# EAGLE design emonTx4-PiPico (EAGLE 9.6.2)
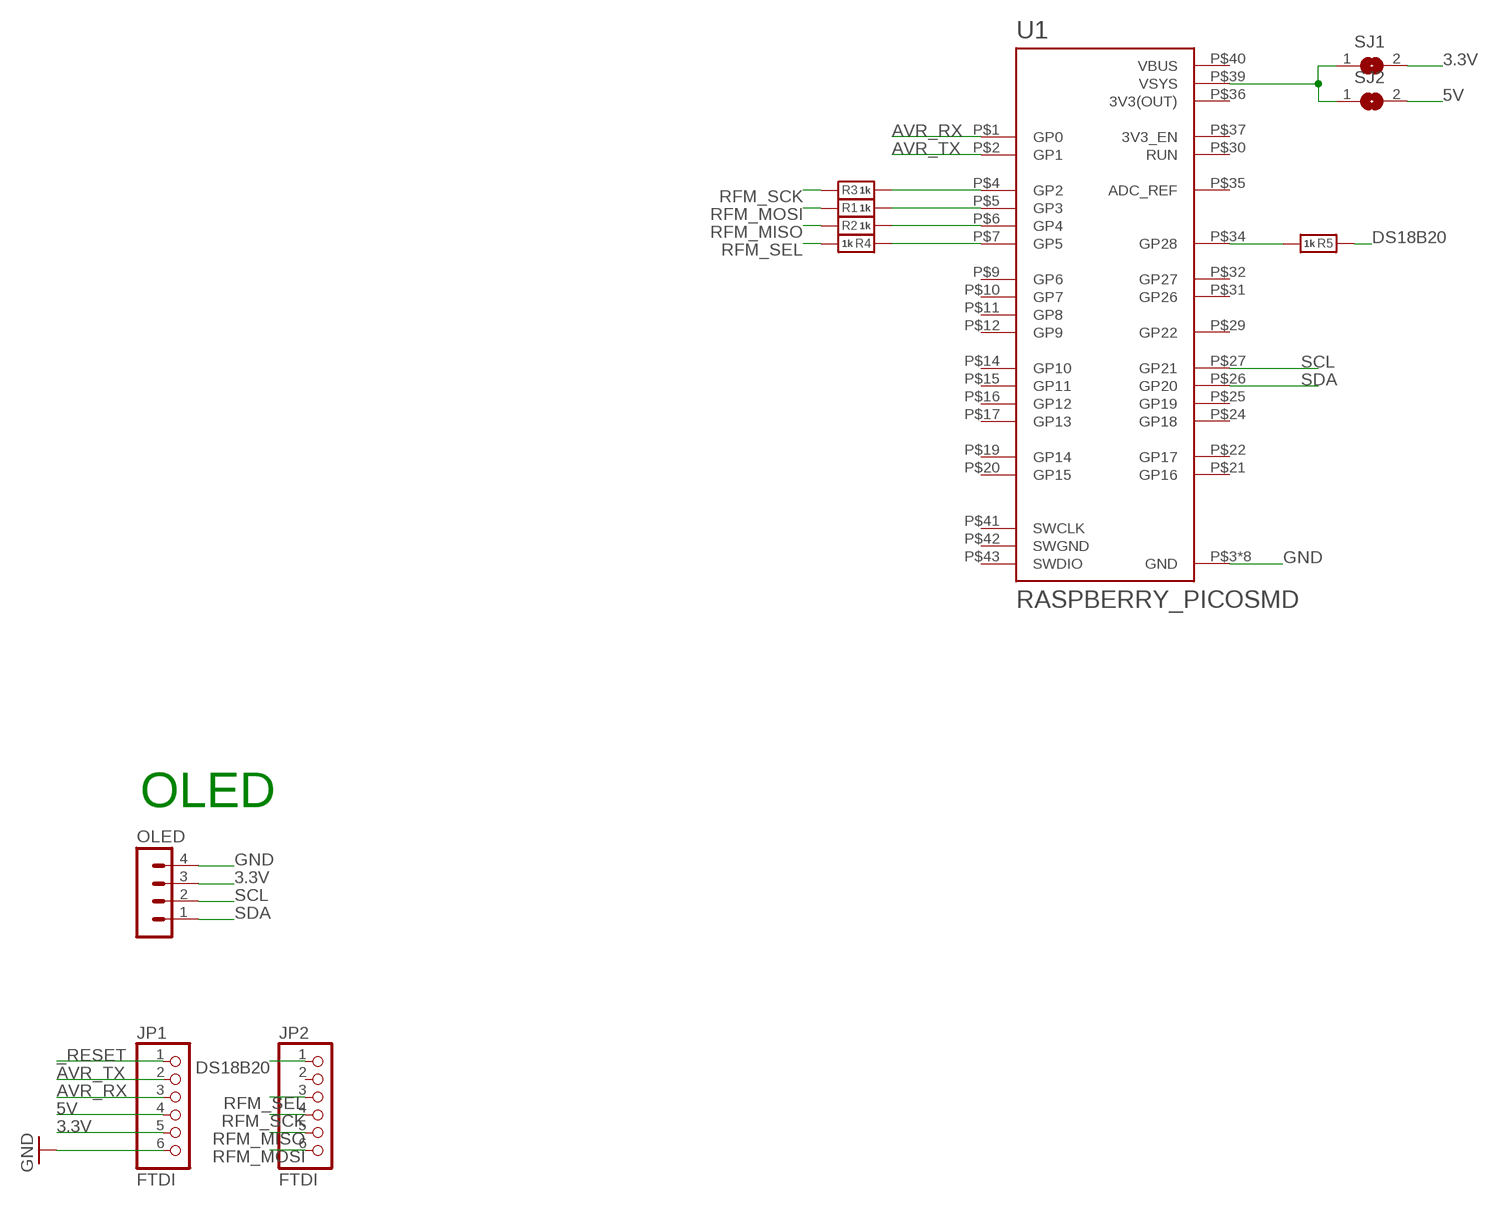
[diagram p0: schematic, sheet 1]

## Parts
JP1  FTDI  HEADER-1X670MIL  [1X06_ROUND_70]
JP2  FTDI  HEADER-1X670MIL  [1X06_ROUND_70]
OLED  MA04-1-OLEDOLED  [MA04-1-OLED]
R1  1k  RESISTOR_0603  [_0603]
R2  1k  RESISTOR_0603  [_0603]
R3  1k  RESISTOR_0603  [_0603]
R4  1k  RESISTOR_0603  [_0603]
R5  1k  RESISTOR_0603  [_0603]
SJ1  SJ  [SJ]
SJ2  SJ  [SJ]
U1  RASPBERRY_PICOSMD  [PICO-PKG-SMD]

## Nets
3.3V: JP1.5 OLED.3 SJ1.2
5V: JP1.4 SJ2.2
_RESET: JP1.1
AVR_RX: JP1.3 U1.P$1(GP0)
AVR_TX: JP1.2 U1.P$2(GP1)
DS18B20: JP2.1 R5.2
GND: JP1.6 OLED.4 U1.P$3(GND) U1.P$8(GND) U1.P$13(GND) U1.P$18(GND) U1.P$23(GND) U1.P$28(GND) U1.P$33(GND) U1.P$38(GND)
N$1: SJ1.1 SJ2.1 U1.P$39(VSYS)
N$4: R3.1 U1.P$4(GP2)
N$5: R1.1 U1.P$5(GP3)
N$6: R2.1 U1.P$6(GP4)
N$7: R4.2 U1.P$7(GP5)
N$8: R5.1 U1.P$34(GP28)
RFM_MISO: JP2.5 R2.2
RFM_MOSI: JP2.6 R1.2
RFM_SCK: JP2.4 R3.2
RFM_SEL: JP2.3 R4.1
SCL: OLED.2 U1.P$27(GP21)
SDA: OLED.1 U1.P$26(GP20)
Unconnected: JP2.2 U1.P$9(GP6) U1.P$10(GP7) U1.P$11(GP8) U1.P$12(GP9) U1.P$14(GP10) U1.P$15(GP11) U1.P$16(GP12) U1.P$17(GP13) U1.P$19(GP14) U1.P$20(GP15) U1.P$21(GP16) U1.P$22(GP17) U1.P$24(GP18) U1.P$25(GP19) U1.P$29(GP22) U1.P$30(RUN) U1.P$31(GP26) U1.P$32(GP27) U1.P$35(ADC_REF) U1.P$37(3V3_EN) U1.P$41(SWCLK) U1.P$43(SWDIO)

## Notes on the sheet
- OLED

## Power pins joined to a net without a drawn wire
3V3(OUT): U1.P$36(3V3(OUT))
SWGND: U1.P$42(SWGND)
VBUS: U1.P$40(VBUS)

## Library data of the parts
JP1 JP2 = microbuilder:HEADER-1X6: PIN HEADER
OLED = con-lstb-db:MA04-1-OLED: PIN HEADER with OLED footprint.
R1-R5 = microbuilder:RESISTOR: Resistors For new designs, use the packages preceded by an '_' character since they are more reliable: The following footprints should be used on most boards: _0402 - Standard footprint for regular board layouts _0603 - Standard footprint for regular board layouts _0805 - Standard footprint for regular board layouts _1206 - Standard footprint for regular board layouts For extremely tight-pitch boards where space is at a premium, the following 'micro-pitch' footprints can be used (smaller pads, no silkscreen outline, etc.): _0402MP - Micro-pitch footprint for very dense/compact boards _0603MP - Micro-pitch footprint for very dense/compact boards _0805MP - Micro-pitch footprint for very dense/compact boards _1206MP - Micro-pitch footprint for very dense/compact boards
SJ1 SJ2 = jumper:SJ: SMD solder JUMPER
U1 = RpiPico:RASPBERRY_PICO: Raspberry Pi Pico

## Net classes
1 power: width 0.254 mm, drill 0.5 mm, clearance 0.152 mm
2 gnd: width 0.254 mm, drill 0.5 mm, clearance 0.152 mm

## Board
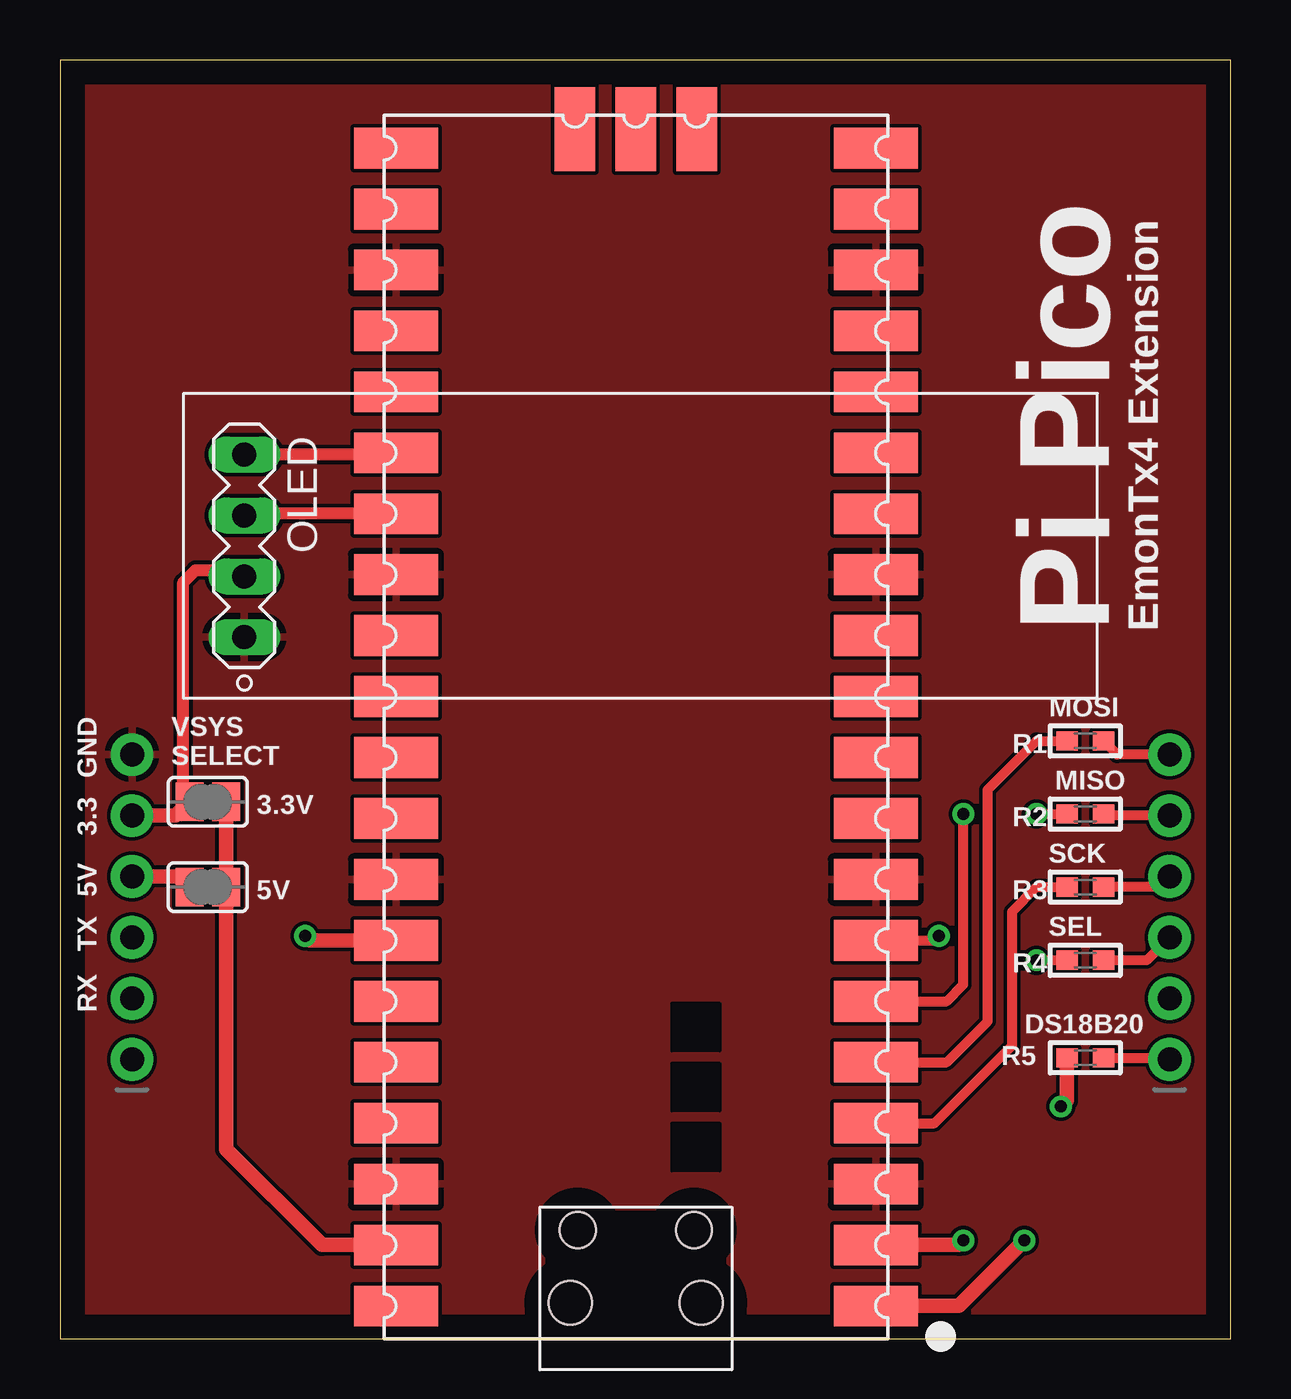
[diagram p1: board, top side]
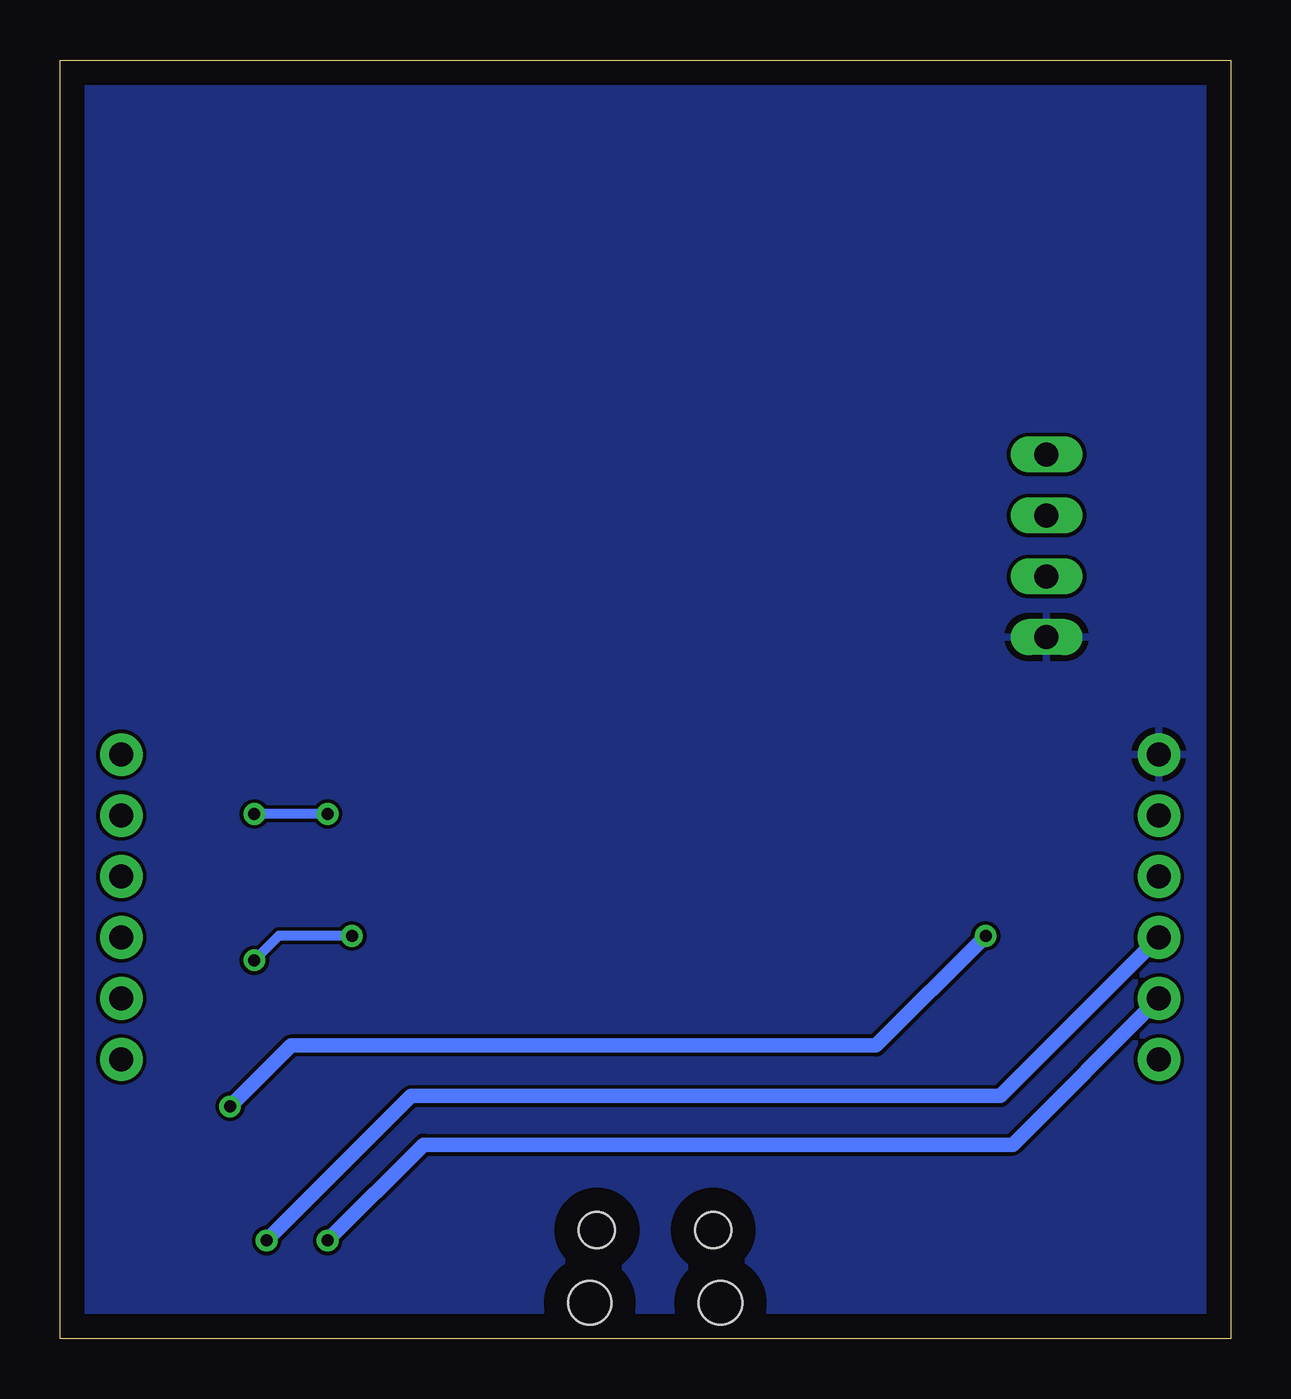
[diagram p2: board, bottom side, seen from below]

Size 48.81 x 53.3 mm. Coordinates in mm from the lower left corner, seen from the top.
Outline: 48.81,0 48.81,53.3 0,53.3 0,0 48.81,0
Copper layers (1*16): Top 0.035mm / dielectric 1.5mm / Bottom 0.035mm
Design rules "default *": minimum track width 6mil, minimum drill 0.35mm, track to track 6mil, track to pad 6mil, pad to pad 6mil, via to via 6mil, smd to smd 6mil, copper to edge 40mil, drill to drill 6mil, minimum pad ring 10mil, minimum via ring 8mil, stop-mask expansion 4mil, vias tented up to drill 0.6mm, thermal gap 10mil

### Footprints (pad centres in the part's own frame; a part is rotated, then mirrored left to right if it is on the bottom)
1X06_ROUND_70 = drill 1 pad 1.778: 1 -6.35,0; 2 -3.81,0; 3 -1.27,0; 4 1.27,0; 5 3.81,0; 6 6.35,0
MA04-1-OLED = drill 1 long: 1 -3.81,0; 2 -1.27,0; 3 1.27,0; 4 3.81,0
_0603 = smd 0.9 x 0.8: 1 -0.762,0; 2 0.762,0
SJ = smd 1.168 x 1.6: 1 -0.762,0; 2 0.762,0
PICO-PKG-SMD = smd 3.5 x 1.7: P$1 -10,24.13; P$2 -10,21.59; P$3 -10,19.05; P$4 -10,16.51; P$5 -10,13.97; P$6 -10,11.43; P$7 -10,8.89; P$8 -10,6.35; P$9 -10,3.81; P$10 -10,1.27; P$11 -10,-1.27; P$12 -10,-3.81; P$13 -10,-6.35; P$14 -10,-8.89; P$15 -10,-11.43; P$16 -10,-13.97; P$17 -10,-16.51; P$18 -10,-19.05; P$19 -10,-21.59; P$20 -10,-24.13; P$21 10,-24.13; P$22 10,-21.59; P$23 10,-19.05; P$24 10,-16.51; P$25 10,-13.97; P$26 10,-11.43; P$27 10,-8.89; P$28 10,-6.35; P$29 10,-3.81; P$30 10,-1.27; P$31 10,1.27; P$32 10,3.81; P$33 10,6.35; P$34 10,8.89; P$35 10,11.43; P$36 10,13.97; P$37 10,16.51; P$38 10,19.05; P$39 10,21.59; P$40 10,24.13 | smd 1.7 x 3.5: P$41 -2.54,-24.925; P$42 0,-24.925; P$43 2.54,-24.925 | hole 1.8: -2.725,24; 2.725,24 | hole 1.5: -2.425,20.97; 2.425,20.97

### Placement (x,y rotation side)
JP1  3,18 90 top
JP2  46.25,18 90 top
OLED  7.68,33.05 270 top
R1  42.74,24.92 0 top
R2  42.74,21.88 0 top
R3  42.74,18.83 0 top
R4  42.74,15.78 180 top
R5  42.74,11.72 0 top
SJ1  6.16,22.38 180 top
SJ2  6.16,18.83 180 top
U1  24,25.5 180 top

### Tracks (layer width: path | path; a pad name or v marks a point on that pad's centre or on a via)
3.3V
  Top 0.508: SJ1.2 5.14,22.64 5.14,31.53 5.65,32.04 7.43,32.04 OLED.3
  Top 0.61: SJ1.2 4.82,21.81 JP1.5
5V
  Top 0.61: SJ2.2 4.96,19.27 JP1.4
AVR_RX  (via drill 0.5)
  Top 0.61: v40.2,4.1 37.47,1.37 U1.P$1
  Bottom 0.61: JP1.3 9.6,10.13 34.17,10.13 v40.2,4.1
AVR_TX  (via drill 0.5)
  Top 0.61: v37.66,4.1 37.47,3.91 U1.P$2
  Bottom 0.61: JP1.2 9.1,8.09 33.66,8.09 v37.66,4.1
DS18B20
  Top 0.406: R5.2 46.18,11.72 JP2.1
GND
  pour Top: -1.27,54.2 -1.27,-1.18 49.27,-1.18 49.27,54.2
  pour Bottom: -0.63,54.07 -0.63,-1.68 49.77,-1.68 49.77,54.07
N$1
  Top 0.61: U1.P$39 10.92,3.91 6.92,7.91 SJ2.1 SJ1.1
N$4
  Top 0.406: U1.P$4 36.45,8.99 39.69,12.22 39.69,17.81 40.7,18.83 R3.1
N$5
  Top 0.406: U1.P$5 36.96,11.53 38.67,13.24 38.67,22.89 40.7,24.92 R1.1
N$6  (via drill 0.5)
  Top 0.406: U1.P$6 36.96,14.07 37.66,14.76 v37.66,21.88 | v40.7,21.88 R2.1
  Bottom 0.406: v37.66,21.88 v40.7,21.88
N$7  (via drill 0.5)
  Top 0.406: U1.P$7 36.45,16.61 v36.64,16.8 | R4.2 v40.7,15.78
  Bottom 0.406: v36.64,16.8 39.69,16.8 v40.7,15.78
N$8  (via drill 0.5)
  Top 0.61: U1.P$34 10.41,16.61 v10.22,16.8 | R5.1 41.97,9.94 v41.72,9.68
  Bottom 0.61: v10.22,16.8 14.8,12.22 39.18,12.22 v41.72,9.68
RFM_MISO
  Top 0.406: JP2.5 43.56,21.81 R2.2
RFM_MOSI
  Top 0.406: JP2.6 44.07,24.35 R1.2
RFM_SCK
  Top 0.406: JP2.4 46.23,19.27 45.78,18.83 R3.2
RFM_SEL
  Top 0.406: JP2.3 45.3,15.78 R4.1
SCL
  Top 0.508: U1.P$27 7.75,34.39 OLED.2
SDA
  Top 0.508: U1.P$26 13.93,36.86 OLED.1

### Text on the board
tNames: Pi Pico | EmonTx4 Extension | MOSI | VSYS / SELECT | GND | MISO | 3.3V | 3.3 | SCK | 5V | 5V | SEL | TX | RX | DS18B20